# EAGLE design Air_Fryer_Coffee_Roaster_V1.0_2022_11_22_REV_B (EAGLE 9.6.1)

## Sheet 1 of 2
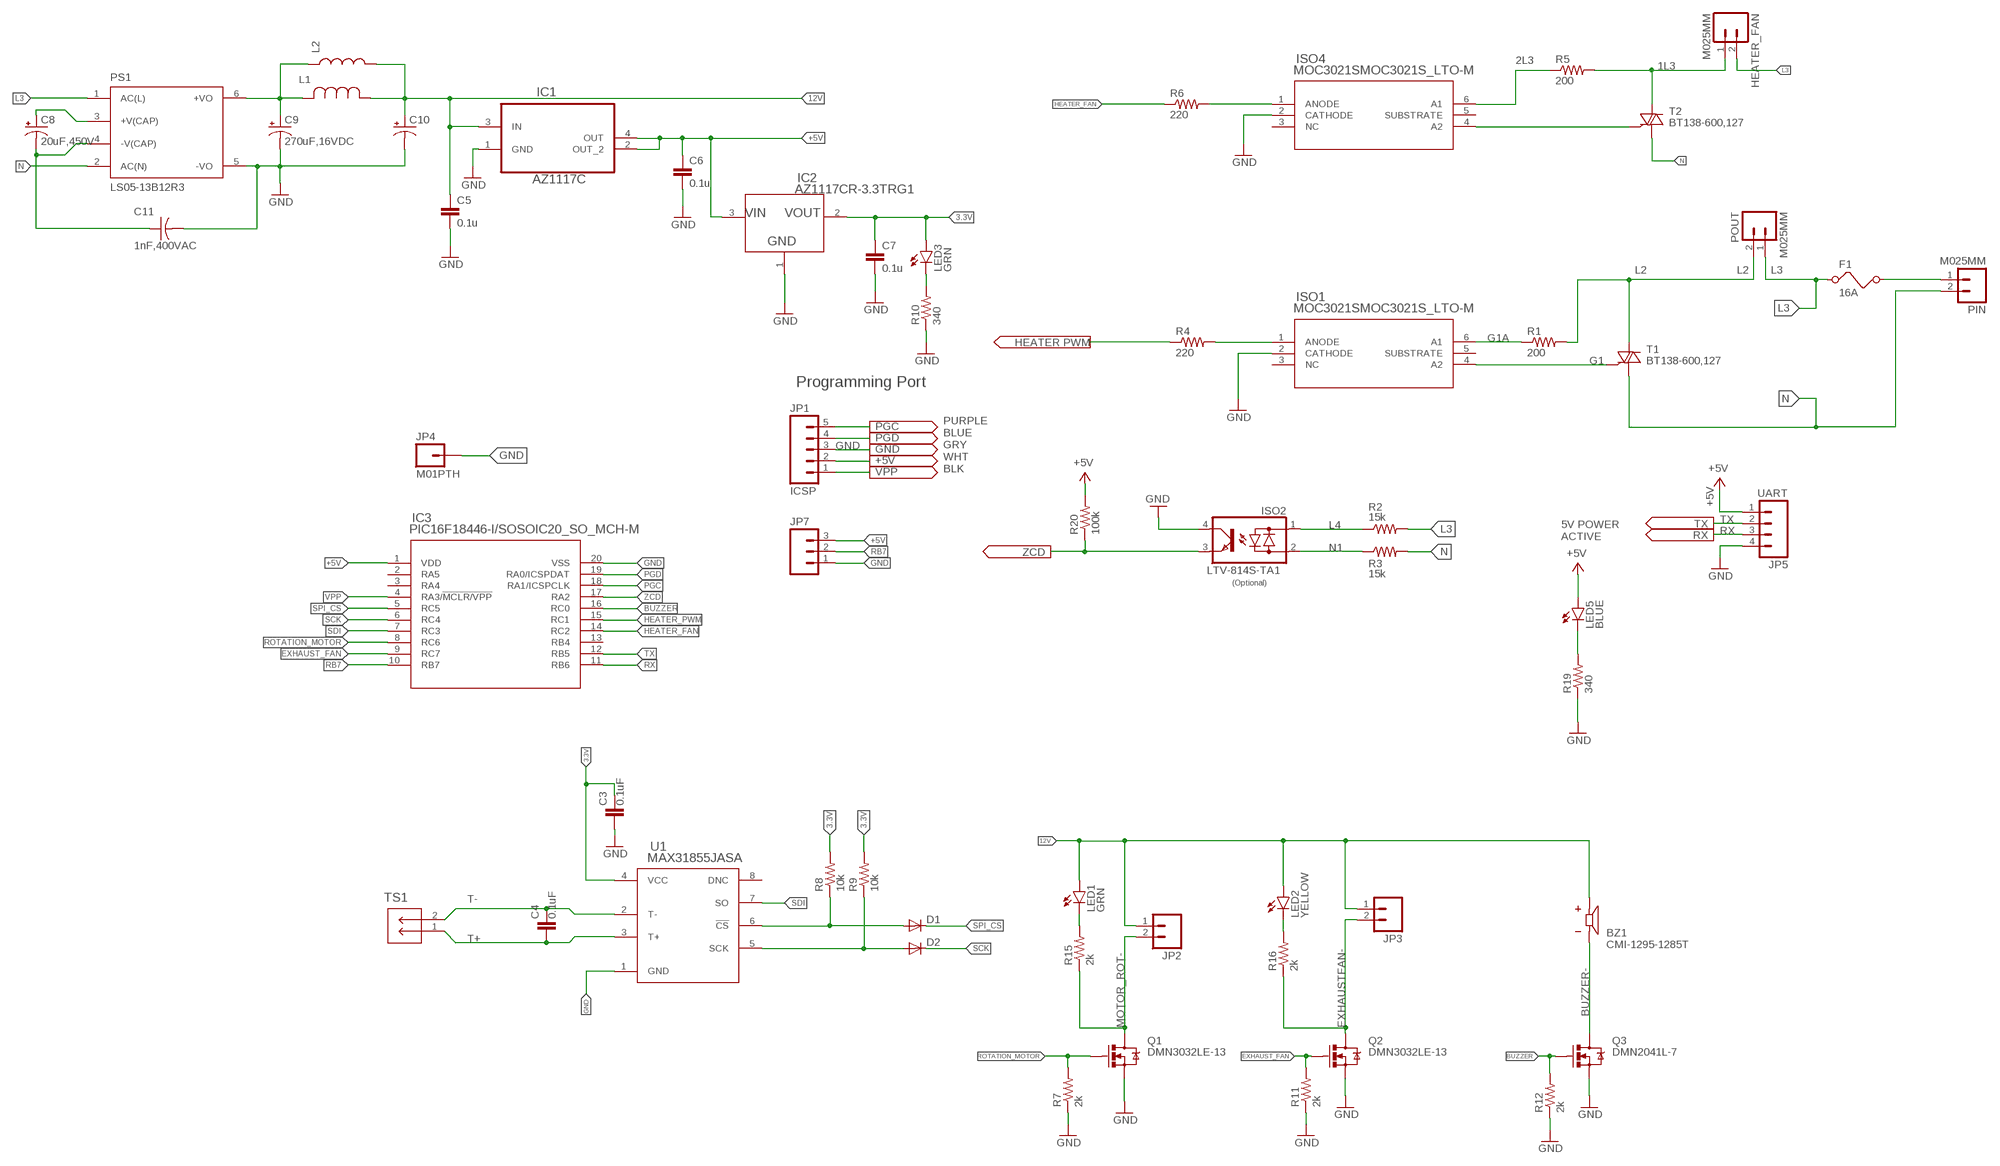
[diagram p0: schematic, sheet 1]

### Parts
BZ1  CMI-1295-1285T  [CUI_CMI-1295-1285T]
C3  0.1uF  CAP0805  [0805]
C4  0.1uF  CAP0805  [0805]
C5  0.1u  CAP1206  [1206]
C6  0.1u  CAP1206  [1206]
C7  0.1u  CAP1206  [1206]
C8  20uF,450V  CPOL-USE5-13  [E5-13]
C9  270uF,16VDC  CAP_POLE  [PANASONIC_E]
C10  CAP_POLE  [PANASONIC_E]
C11  1nF,400VAC  C-US050-075X075  [C050-075X075]
D1  DIODESOD-323F  [SOD-323F]
D2  DIODESOD-323F  [SOD-323F]
F1  16A  FUSE  [FUSE]
HEATER_FAN  M025MM  [SCREWTERMINAL-5MM-2]
IC1  AZ1117C  ADP3338AKCZ-5-R7  [SOT230P700X180-4N]
IC2  AZ1117CR-3.3TRG1  [SOT89_AZ1117_DIO]
IC3  PIC16F18446-I/SOSOIC20_SO_MCH-M  [SOIC20_SO_MCH-M]
ISO1  MOC3021SMOC3021S_LTO-M  [MOC3021S_LTO-M]
ISO2  LTV-814S-TA1  SFH6206  [DIL4-SMD]
ISO4  MOC3021SMOC3021S_LTO-M  [MOC3021S_LTO-M]
JP1  ICSP  M05PTH  [1X05]
JP2  M02POLAR_LOCK  [MOLEX-1X2_LOCK]
JP3  M02POLAR_LOCK  [MOLEX-1X2_LOCK]
JP4  M01PTH  [1X01]
JP5  UART  M04LOCK  [1X04_LOCK]
JP7  M03LOCK  [1X03_LOCK]
L1  4.7uH, 2.2A  SRR1260-100M  [IND_BOURNS_SRR1260]
L2  INDUCTORCR54  [CR54]
LED1  GRN  LED1206  [LED-1206]
LED2  YELLOW  LED1206  [LED-1206]
LED3  GRN  LED1206  [LED-1206]
LED5  BLUE  LED1206  [LED-1206]
PIN  M025MM  [SCREWTERMINAL-5MM-2]
POUT  M025MM  [SCREWTERMINAL-5MM-2]
PS1  LS05-13B12R3  [CONV_LS05-13B12R3]
Q1  DMN3032LE-13  NFET_SOT_223  [SOT223]
Q2  DMN3032LE-13  NFET_SOT_223  [SOT223]
Q3  DMN2041L-7  MOSFET-NCHANNELBSS123LT1G  [SOT23-3]
R1  200  R-US_R2512  [R2512]
R2  15k  R-US_R2512  [R2512]
R3  15k  R-US_R2512  [R2512]
R4  220  RESISTOR1206  [1206]
R5  200  R-US_R2512  [R2512]
R6  220  RESISTOR1206  [1206]
R7  2k  RESISTOR1206  [1206]
R8  10k  R-US_M0805  [M0805]
R9  10k  R-US_M0805  [M0805]
R10  340  RESISTOR1206  [1206]
R11  2k  RESISTOR1206  [1206]
R12  2k  RESISTOR1206  [1206]
R15  2k  RESISTOR1206  [1206]
R16  2k  RESISTOR1206  [1206]
R19  340  RESISTOR1206  [1206]
R20  100k  RESISTOR1206  [1206]
T1  BT138-600,127  BT138-V  [TO220BV]
T2  BT138-600,127  BT138-V  [TO220BV]
TS1  YK3210203000G  282845-2  [CONN2_282845-2_TEC]
U1  MAX31855JASA  MAX31855JASA+21-0041B_8_MXM-M  [21-0041B_8_MXM-M]

### Nets
1L3: HEATER_FAN.1 R5.2 T2.T2(A2)
2L3: ISO4.6(A1) R5.1
3.3V: C3.2 C7.1 IC2.2(OUTPUT) LED3.A R8.2 R9.2 U1.4(VCC)
12V: BZ1.P C5.1 C10.+ IC1.3(IN) JP2.1 JP3.1 L1.1 L2.P$2 LED1.A LED2.A
+5V: C6.1 IC1.2(OUT_2) IC1.4(OUT) IC2.3(INPUT) IC3.1(VDD) JP1.2 JP5.1 JP7.3 LED5.A R20.2
BUZZER: IC3.16(RC0) Q3.1(G) R12.2
BUZZER-: BZ1.N Q3.3(D)
EXHAUST_FAN: IC3.9(RC7) Q2.1(G) R11.2
EXHAUSTFAN-: JP3.2 Q2.2(D) Q2.4(D) R16.1
G1: ISO1.4(A2) T1.G
G1A: ISO1.6(A1) R1.1
GATE_2: ISO4.4(A2) T2.G
GND: C3.1 C5.2 C6.2 C7.2 C9.- C10.- C11.2 IC1.1(GND) IC2.1(ADJ/GND) IC3.20(VSS) ISO1.2(CATHODE) ISO2.4(C) ISO4.2(CATHODE) JP1.3 JP4.1 JP5.4 JP7.1 PS1.5(-VO) Q1.3(S) Q2.3(S) Q3.2(S) R7.1 R10.1 R11.1 R12.1 R19.1 U1.1(GND)
HEATER_FAN: IC3.14(RC2) R6.1
HEATER_PWM: IC3.15(RC1) R4.1
L1: F1.2 PIN.1
L2: POUT.2 R1.2 T1.T2(A2)
L3: F1.1 HEATER_FAN.2 POUT.1 PS1.1(AC(L)) R2.2
L4: ISO2.1(AC1) R2.1
MOTOR_ROT-: JP2.2 Q1.2(D) Q1.4(D) R15.1
N: PIN.2 PS1.2(AC(N)) R3.2 T1.T1(A1) T2.T1(A1)
N1: ISO2.2(AC2) R3.1
N$1: ISO1.1(ANODE) R4.2
N$2: LED3.C R10.2
N$3: LED1.C R15.2
N$4: LED2.C R16.2
N$6: C8.+ PS1.3(+V(CAP))
N$7: C8.- C11.1 PS1.4(-V(CAP))
N$8: ISO4.1(ANODE) R6.2
N$12: D1.A R8.1 U1.6(!CS)
N$13: LED5.C R19.2
N$14: D2.A R9.1 U1.5(SCK)
N$15: C9.+ L1.2 L2.P$1 PS1.6(+VO)
PGC: IC3.18(RA1/ICSPCLK) JP1.5
PGD: IC3.19(RA0/ICSPDAT) JP1.4
RB7: IC3.10(RB7) JP7.2
ROTATION_MOTOR: IC3.8(RC6) Q1.1(G) R7.2
RX: IC3.11(RB6) JP5.3
SCK: D2.C IC3.6(RC4)
SDI: IC3.7(RC3) U1.7(SO)
SPI_CS: D1.C IC3.5(RC5)
T+: C4.1 TS1.1 U1.3(T+)
T-: C4.2 TS1.2 U1.2(T-)
TX: IC3.12(RB5) JP5.2
VPP: IC3.4(RA3/!MCLR/VPP) JP1.1
ZCD: IC3.17(RA2) ISO2.3(E) R20.1
Unconnected: IC3.2(RA5) IC3.3(RA4) IC3.13(RB4) ISO1.3(NC) ISO1.5(SUBSTRATE) ISO4.3(NC) ISO4.5(SUBSTRATE) U1.8(DNC)

### Notes on the sheet
- Programming Port
- PURPLE
  BLUE
  GRY
  WHT
  BLK
- 5V POWER
  ACTIVE
- (Optional)

## Sheet 2 of 2

## Library data of the parts
BZ1 = CMI-1295-1285T:CMI-1295-1285T: CUI Inc Buzzer Check availability <https://pricing.snapeda.com/parts/CMI-1295-1285T/CUI%20Devices/view-part?ref=eda>; AVAILABILITY: In Stock; CUI_PURCHASE_URL: https://www.cuidevices.com/product/audio/buzzers/audio-indicators/cmi-1295-1285t?utm_source=snapeda.com&utm_medium=referral&utm_campaign=snapedaBOM; DESCRIPTION: 12 mm, 12 Vdc, 85 dB, Through Hole, Driving Circuit, Magnetic Audio Indicator Buzzer; MF: CUI Devices; MP: CMI-1295-1285T; PACKAGE: CUI Inc.; PRICE: None; PURCHASE-URL: https://pricing.snapeda.com/search/part/CMI-1295-1285T/?ref=eda
C3 C4 = SparkFun-Capacitors:CAP: Capacitor Standard 0603 ceramic capacitor, and 0.1" leaded capacitor.
C5-C7 = SparkFun:CAP: Capacitor Standard 0603 ceramic capacitor, and 0.1" leaded capacitor.
C8 = rcl:CPOL-US: POLARIZED CAPACITOR, American symbol; SPICEPREFIX: C
C9 C10 = SparkFun:CAP_POL: Capacitor Polarized These are standard SMD and PTH capacitors. Normally 10uF, 47uF, and 100uF in electrolytic and tantalum varieties. Always verify the external diameter of the through hole cap, it varies with capacity, voltage, and manufacturer. The EIA devices should be standard.
C11 = rcl:C-US: CAPACITOR, American symbol; SPICEPREFIX: C
D1 D2 = adafruit:DIODE: Diode SMADIODE - SMA Surface Mount Package 20V 1A Schottky Diode Digikey: 641-1014-6-ND DO-1N4148 - Through Hole Small Current Diode SOD-123 20V 1 A (.5mV Vf) Schottky Diode - Digikey: MBRX120TPMSCT-ND SOD-323 10V 570mA (.38mV Vf, 3ns) Schottky Diode - Digikey: ZLLS410CT-ND SOD-523 30V 30mA Schottky Diode (RB751S-40TE61) - Digikey: RB751S-40TE61CT-ND SOT23-R/W - SOT23 Package (R = Solder Paste/Reflow Ovens, W = Hand-Soldering) BAT54Film 40V 300mA - Digikey: 497-7162-1-ND
F1 = special:FUSE: FUSE 5 x 20 mm
HEATER_FAN PIN POUT = SparkFun-Connectors:M02: Standard 2-pin 0.1" header. Use with - straight break away headers ( PRT-00116) - right angle break away headers (PRT-00553) - swiss pins (PRT-00743) - machine pins (PRT-00117) - female headers (PRT-00115) Molex polarized connector foot print use with: PRT-08233 with associated crimp pins and housings. 2.54_SCREWTERM for use with PRT-10571. 3.5mm Screw Terminal footprints for PRT-08084 5mm Screw Terminal footprints for use with PRT-08432; STOREFRONT_ID: PRT-08432
IC1 = ADI-Phase-2:ADP3338AKCZ-5-R7: Low Dropout Regulator; MPN: ADP3338AKCZ-5-R7; OC_FARNELL: 1319314; OC_NEWARK: 19M8721; PACKAGE: SOT-223-3; SUPPLIER: Analog Devices
IC2 = AZ1117CR-3.3TRG1:AZ1117CR-3.3TRG1; COPYRIGHT: Copyright (C) 2022 Ultra Librarian. All rights reserved.; DIGI-KEY_PART_NUMBER_1: AZ1117CR-3.3TRG1DITR-ND; DIGI-KEY_PART_NUMBER_2: AZ1117CR-3.3TRG1DICT-ND; DIGI-KEY_PART_NUMBER_3: AZ1117CR-3.3TRG1DIDKR-ND; MANUFACTURER_PART_NUMBER: AZ1117CR-3.3TRG1; MFR_NAME: Diodes Inc
IC3 = PIC16F18446:PIC16F18446-I/SO; COPYRIGHT: Copyright (C) 2022 Ultra Librarian. All rights reserved.; MANUFACTURER_PART_NUMBER: PIC16F18446-I/SO; MFR_NAME: Microchip
ISO1 ISO4 = MOC3021S:MOC3021S; BUILT_BY: EMA_Cory; COPYRIGHT: Copyright (C) 2018 Accelerated Designs. All rights reserved; MANUFACTURER_PART_NUMBER: MOC3021S; SOURCELIBRARY: Lite-On_2019-12-03; VENDOR: Lite-On
ISO2 = optocoupler:SFH620: Optocoupler, Phototransistor Output, AC Input Source: http://www.vishay.com/docs/83675/sfh620.pdf; MF: VISHAY/TELEFUNKEN; MPN: SFH6206-3; OC_FARNELL: 1469585; OC_NEWARK: 58K2214
JP1 = SparkFun-Connectors:M05: Header 5 Standard 5-pin 0.1" header. Use with straight break away headers (SKU : PRT-00116), right angle break away headers (PRT-00553), swiss pins (PRT-00743), machine pins (PRT-00117), and female headers (PRT-00115). Molex polarized connector foot print use with SKU : PRT-08230 with associated crimp pins and housings.
JP2 JP3 = SparkFun:M02: Header 2 Standard 2-pin 0.1" header. Use with straight break away headers (SKU : PRT-00116), right angle break away headers (PRT-00553), swiss pins (PRT-00743), machine pins (PRT-00117), and female headers (PRT-00115). Molex polarized connector foot print use with SKU : PRT-08233 with associated crimp pins and housings.
JP4 = SparkFun-Connectors:M01: Header 1 Standard 1-pin 0.1" header. Use with straight break away headers (SKU : PRT-00116), right angle break away headers (PRT-00553), swiss pins (PRT-00743), machine pins (PRT-00117), and female headers (PRT-00115).
JP5 = SparkFun-Connectors:M04: Header 4 Standard 4-pin 0.1" header. Use with straight break away headers (SKU : PRT-00116), right angle break away headers (PRT-00553), swiss pins (PRT-00743), machine pins (PRT-00117), and female headers (PRT-00115). Molex polarized connector foot print use with SKU : PRT-08231 with associated crimp pins and housings. 1MM SMD Version SKU: PRT-10208
JP7 = SparkFun:M03: Header 3 Standard 3-pin 0.1" header. Use with straight break away headers (SKU : PRT-00116), right angle break away headers (PRT-00553), swiss pins (PRT-00743), machine pins (PRT-00117), and female headers (PRT-00115). Molex polarized connector foot print use with SKU : PRT-08232 with associated crimp pins and housings.
L1 = SRR1260 Series:SRR1260-100M; COPYRIGHT: Copyright (C) 2021 Ultra Librarian. All rights reserved.; DIGI-KEY_PART_NUMBER_1: SRR1260-100MCT-ND; DIGI-KEY_PART_NUMBER_2: SRR1260-100MDKR-ND; DIGI-KEY_PART_NUMBER_3: SRR1260-100MTR-ND; MANUFACTURER_PART_NUMBER: SRR1260-100M; MFR_NAME: Bourns Electronics
L2 = SparkFun:INDUCTOR: Inductors Basic Inductor/Choke - 0603 and 1206. Footprints are not proven and vary greatly between part numbers.
LED1-LED3 LED5 = SparkFun-LED:LED: LEDs Standard schematic elements and footprints for 5mm, 3mm, 1206, and 0603 sized LEDs. 5mm - Spark Fun Electronics SKU : COM-00529 (and others)
PS1 = LS05-13B12R3:LS05-13B12R3; DESCRIPTION: Open Frame AC DC Converters 1 Uitgang 12V - - - 420mA 85 ~ 305 VAC, 70 ~ 430 VDC Input; DIGI-KEY_PART_NUMBER: 2725-LS05-13B12R3-ND; MF: Mornsun America, LLC; MP: LS05-13B12R3; PACKAGE: CUSTOM-6 MORNSUN; PURCHASE-URL: https://pricing.snapeda.com/search/part/LS05-13B12R3/?ref=eda
Q1 Q2 = NFET_LIB:NFET_SOT_223
Q3 = SparkFun-DiscreteSemi:MOSFET-NCHANNEL: Common NMOSFET Parts MFG P/N Store ID Prod ID FDD8780 TRANS-09984 SI7820DN TRANS-11055 FDS6630A IC-08089 2N7002PW TRANS-11151 FQP30N06L COM-10213 TRANS-10060 BSS123LT1G TRANS-08345 BSS138 TRANS-00830 BS170 2N7000; PROD_ID: TRANS-08345
R1-R3 R5 = rcl:R-US_: RESISTOR, American symbol; SPICEPREFIX: R
R4 R6 R7 R10-R12 R15 R16 R19 R20 = SparkFun-Resistors:RESISTOR: Resistor Basic schematic elements and footprints for 0603, 1206, and PTH resistors.
R8 R9 = adafruit:R-US_: RESISTOR, American symbol
T1 T2 = triac:BT138: TRIAC Source: http://www.semiconductors.philips.com BT138_SERIES_2.pdf
TS1 = 7_62_2pole_term_block:282845-2; COPYRIGHT: Copyright (C) 2022 Ultra Librarian. All rights reserved.; MANUFACTURER_PART_NUMBER: 282845-2; MFR_NAME: TE Connectivity
U1 = MAX31855:MAX31855JASA+; COPYRIGHT: Copyright (C) 2022 Ultra Librarian. All rights reserved.; MANUFACTURER_PART_NUMBER: MAX31855JASA+; MFR_NAME: Maxim Integrated Products

## Board
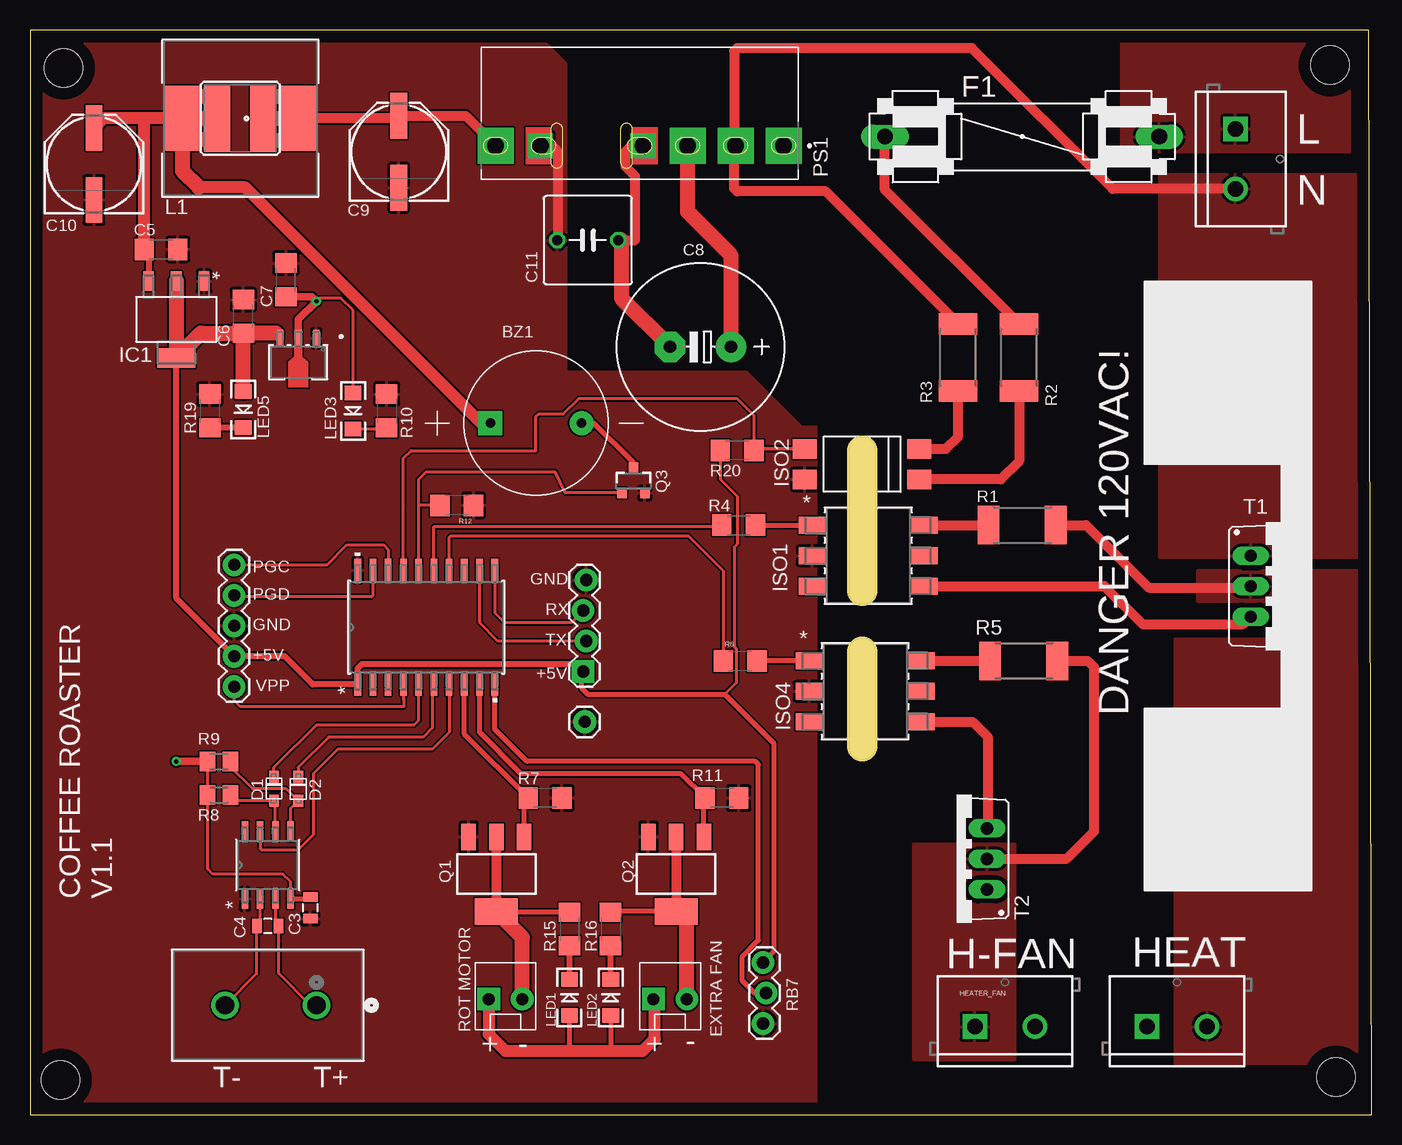
[diagram p1: board, top side]
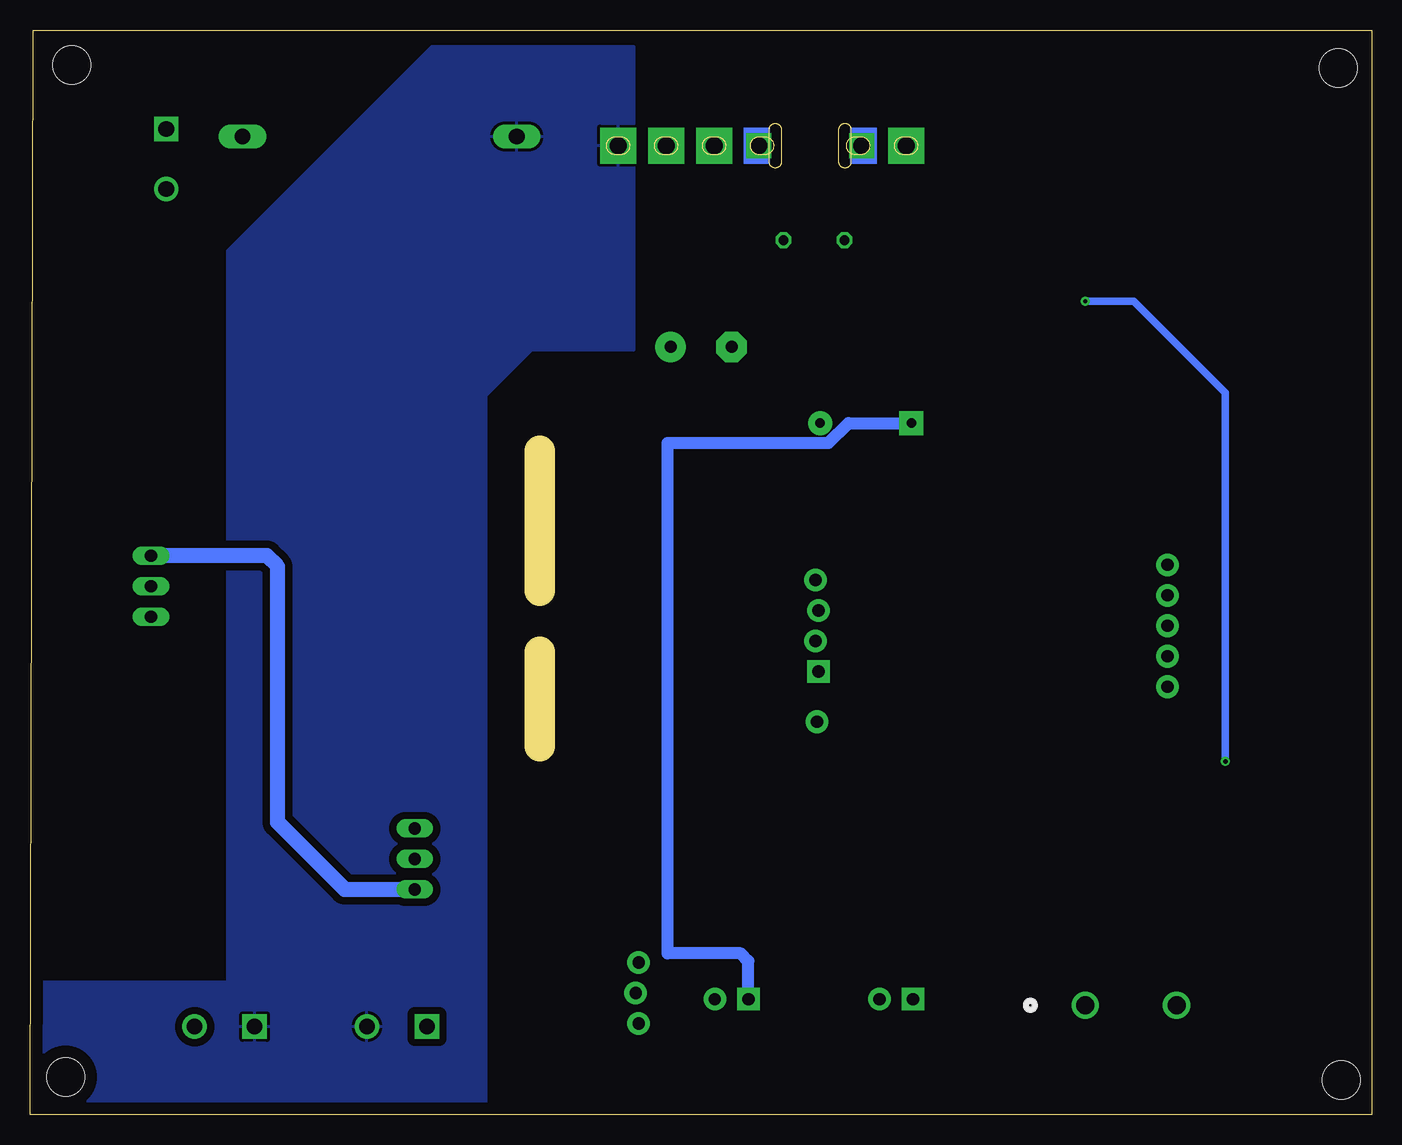
[diagram p2: board, bottom side, seen from below]

Size 111.81 x 90.41 mm. Coordinates in mm from the lower left corner, seen from the top.
Outline: 69.34,55.24 69.34,43.94
Outline: 0,0 111.81,0 111.56,90.41 0,90.41 0,0
Copper layers (1*16): Top 0.035mm / dielectric 1.5mm / Bottom 0.035mm
Design rules "default": minimum track width 10mil, minimum drill 0.35mm, track to track 6mil, track to pad 6mil, pad to pad 6mil, via to via 6mil, smd to smd 6mil, copper to edge 40mil, drill to drill 6mil, minimum pad ring 10mil, minimum via ring 8mil, stop-mask expansion 4mil, vias tented up to drill 0mil, thermal gap 10mil
Holes 3.17 mm at 2.54,2.92 108.84,3.17 108.33,87.5 2.79,87.25
tKeepout: area 66.8,2.8 to 71.9,56.8
Milling: 2 lines

### Footprints (pad centres in the part's own frame; a part is rotated, then mirrored left to right if it is on the bottom)
CUI_CMI-1295-1285T = drill 0.8 pad 2: N 3.8,0 | drill 0.8 pad 2 square: P -3.8,0
0805 = smd 0.8 x 1.2: 1 -0.9,0; 2 0.9,0
1206 = smd 1.6 x 1.8: 1 -1.4,0; 2 1.4,0
E5-13 = drill 1.016 pad 2.54: + -2.54,0 | drill 1.016 pad 2.54 octagon: - 2.54,0
PANASONIC_E = smd 3.8 x 1.4: + 3,0; - -3,0
C050-075X075 = drill 0.813 octagon: 1 -2.54,0; 2 2.54,0
SOD-323F = smd 1 x 0.8: A -1,0; C 1,0
FUSE = drill 1.321 long: 1 -11.43,0; 2 11.43,0
SCREWTERMINAL-5MM-2 = drill 1.3 pad 2.032 square: 1 0,0 | drill 1.3 pad 2.032: 2 5,0
SOT230P700X180-4N = smd 1.626 x 0.889: 1 -3.2,2.311; 2 -3.2,0; 3 -3.2,-2.311 | smd 1.626 x 3.175: 4 3.2,0
SOT89_AZ1117_DIO = smd 0.533 x 1.397: 1 -1.5,-1.994; 3 1.5,-1.994 | smd 0.61 x 1.397: 2 0,-1.994
SOIC20_SO_MCH-M = smd 1.905 x 0.559: 1 -4.763,5.715; 2 -4.763,4.445; 3 -4.763,3.175; 4 -4.763,1.905; 5 -4.763,0.635; 6 -4.763,-0.635; 7 -4.763,-1.905; 8 -4.763,-3.175; 9 -4.763,-4.445; 10 -4.763,-5.715; 11 4.763,-5.715; 12 4.763,-4.445; 13 4.763,-3.175; 14 4.763,-1.905; 15 4.763,-0.635; 16 4.763,0.635; 17 4.763,1.905; 18 4.763,3.175; 19 4.763,4.445; 20 4.763,5.715
MOC3021S_LTO-M = smd 2.261 x 1.397: 1 -4.661,2.54; 2 -4.661,0; 3 -4.661,-2.54; 4 4.661,-2.54; 5 4.661,0; 6 4.661,2.54
DIL4-SMD = smd 1.6 x 2: 1 -1.27,-4.77; 2 1.27,-4.77; 3 1.27,4.77; 4 -1.27,4.77
1X05 = drill 1.016 pad 1.88: 1 0,0; 2 2.54,0; 3 5.08,0; 4 7.62,0; 5 10.16,0
MOLEX-1X2_LOCK = drill 1.016 pad 1.88 square: 1 -0.127,0 | drill 1.016 pad 1.88: 2 2.667,0
1X01 = drill 1.016 pad 1.88: 1 0,0
1X04_LOCK = drill 1.016 pad 1.88 square: 1 0,0.127 | drill 1.016 pad 1.88: 2 2.54,-0.127; 3 5.08,0.127; 4 7.62,-0.127
1X03_LOCK = drill 1.016 pad 1.88: 1 0,0.127; 2 2.54,-0.127; 3 5.08,0.127
IND_BOURNS_SRR1260 = smd 2.896 x 5.41: 1 -4.851,0; 2 4.851,0
CR54 = smd 5.5 x 2.15: P$1 0,1.92; P$2 0,-1.92
LED-1206 = smd 1.2 x 1.4: A -1.5,0; C 1.5,0
CONV_LS05-13B12R3 = drill 1.4 pad 3 square: 1 -12,0; 2 -8,0; 3 -4,0; 6 12,0 | drill 1.4 pad 1.78 square: 4 -0.29,0; 5 8.29,0
SOT223 = smd 1.219 x 2.235: 1 -2.311,-3.099; 2 0,-3.099; 3 2.311,-3.099 | smd 3.6 x 2.2: 4 0,3.099
SOT23-3 = smd 0.8 x 0.9: 1 -0.95,-1; 2 0.95,-1; 3 0,1.1
R2512 = smd 1.8 x 3.2: 1 -2.8,0; 2 2.8,0
M0805 = smd 1.3 x 1.6: 1 -0.95,0; 2 0.95,0
TO220BV = drill 1.016 long: G 2.54,-2.54; T1 -2.54,-2.54; T2 0,-2.54
CONN2_282845-2_TEC = drill 1.524 pad 2.032: 1 0,0; 2 7.62,0
21-0041B_8_MXM-M = smd 1.664 x 0.533: 1 -2.826,1.905; 2 -2.826,0.635; 3 -2.826,-0.635; 4 -2.826,-1.905; 5 2.826,-1.905; 6 2.826,-0.635; 7 2.826,0.635; 8 2.826,1.905

### Placement (x,y rotation side)
BZ1  42.16,57.66 0 top
C3  23.37,17.27 90 top
C4  19.81,15.75 180 top
C5  10.92,72.14 0 top
C6  17.78,66.55 90 top
C7  21.34,69.6 90 top
C8  55.88,64.01 180 top
C9  30.73,80.26 90 top
C10  5.33,79.25 90 top
C11  46.48,72.9 180 top
D1  20.32,27.19 90 top
D2  22.35,27.18 90 top
F1  82.68,81.53 0 top
HEATER_FAN  78.74,7.37 0 top
HEATSINK  [7-345-2PP-BA]  106.81,44.07 90 top
IC1  12.19,66.29 270 top
IC2  22.35,62.74 180 top
IC3  33.02,40.64 90 top
ISO1  69.85,46.61 0 top
ISO2  69.34,54.23 90 top
ISO4  69.6,35.31 0 top
JP1  17.02,35.69 90 top
JP2  38.35,9.65 0 top
JP3  52.07,9.65 0 top
JP4  46.23,32.77 0 top
JP5  46.23,36.96 90 top
JP7  61.21,7.62 90 top
L1  17.53,83.06 0 top
L2  17.53,83.06 270 top
LED1  44.96,9.78 90 top
LED2  48.39,9.78 90 top
LED3  26.92,58.67 270 top
LED5  17.78,58.8 270 top
PIN  100.46,82.17 270 top
POUT  93.09,7.37 0 top
PS1  50.8,80.77 180 top
Q1  38.86,20.07 180 top
Q2  53.85,20.07 180 top
Q3  50.29,52.83 0 top
R1  82.68,49.15 0 top
R2  82.42,63.12 90 top
R3  77.34,63.12 90 top
R4  59.05,49.15 0 top
R5  82.8,37.85 0 top
R6  59.18,37.85 0 top
R7  42.93,26.42 180 top
R8  15.75,26.67 180 top
R9  15.75,29.46 180 top
R10  29.72,58.67 270 top
R11  57.66,26.42 180 top
R12  35.56,50.8 180 top
R15  44.96,15.49 270 top
R16  48.39,15.49 270 top
R19  14.99,58.67 270 top
R20  58.93,55.37 180 top
T1  104.27,44.07 270 top
T2  77.22,21.34 90 top
TS1  23.88,9.14 180 top
U1  19.81,20.83 90 top

### Tracks (layer width: path | path; a pad name or v marks a point on that pad's centre or on a via)
1L3
  Top 0.813: R5.2 88.14,37.85 88.65,37.34 88.65,23.62 86.33,21.31 79.78,21.31 T2.T2
  pour Top (isolate 0.406): 73.66,22.61 82.04,22.61 82.04,4.57 73.66,4.57
2L3
  Top 0.813: ISO4.6 R5.1
3.3V  (via drill 0.35)
  Top 0.254: R9.2 R8.2 14.8,20.51 15.24,20.07 21.08,20.07 21.72,19.43 U1.4 | LED3.A 26.92,67.06 25.91,68.07 24.13,68.07 v23.88,67.82
  Top 0.406: U1.4 23.22,18 C3.2
  Top 0.61: R9.2 v12.19,29.46 | IC2.2 22.35,66.29 v23.88,67.82 23.5,68.2 C7.1
  Bottom 0.61: v12.19,29.46 12.19,60.2 19.81,67.82 v23.88,67.82
12V
  Top 0.406: LED1.A 44.96,5.33 | LED2.A 48.39,5.46 48.26,5.33
  Top 0.508: C5.1 9.88,71.78 IC1.3
  Top 1.016: JP2.1 38.23,6.73 39.62,5.33 44.96,5.33 48.26,5.33 51.05,5.33 52.07,6.35 52.07,9.53 JP3.1 | BZ1.P 37.6,57.66 17.96,77.3 14.06,77.3 | 9.4,83.06 L1.1 13.21,83.59 13.21,83.82 12.7,83.31 12.7,82.8 | 9.4,83.06 6.14,83.06 C10.+ | C5.1 9.52,82.93 9.4,83.06
  Top 1.27: 14.06,77.3 12.7,78.66 12.7,81.28 | 12.7,81.28 12.7,82.8 12.7,84.58 12.95,84.84 15.49,84.84 15.49,83.17 L2.P$2 | L1.1 L2.P$2 | L2.P$2 15.61,81.39 15.49,81.28 12.7,81.28
  Top 2.54: 12.95,83.06 12.7,83.31
  Bottom 1.016: JP3.1 51.94,12.83 52.58,13.46 58.67,13.46 58.67,56 45.28,56 43.62,57.66 BZ1.P
+5V
  Top 0.254: R20.2 57.53,52.96 58.93,51.56 58.93,47.56 58.67,47.31 58.67,39.05 58.86,38.86 58.86,36 57.91,35.05 | 45.97,35.56 45.97,35.81
  Top 0.406: JP7.3 61.98,13.59 61.98,30.99 57.91,35.05 46.48,35.05 45.97,35.56 | 45.97,35.81 45.97,36.83 JP5.1
  Top 0.508: IC1.4 12.19,43.05 JP1.2 21.21,38.23 23.56,35.88 IC3.1 27.3,37.21 27.69,37.59 45.47,37.59 JP5.1
  Top 0.61: IC2.3 20.52,65.06 20.52,65.15
  Top 1.27: C6.1 14.25,65.15 IC1.4 IC1.2 | 20.52,65.15 C6.1 | LED5.A C6.1
BUZZER
  Top 0.254: IC3.16 32.38,50.8 | 32.38,50.8 32.38,52.96 33.02,53.59 43.76,53.59 44.59,51.83 Q3.1 48.91,51.83 | R12.2 32.38,50.8
BUZZER-
  Top 0.406: BZ1.N 46.98,57.66 50.29,54.35 Q3.3
EXHAUST_FAN
  Top 0.406: Q2.1 56.16,26.32 R11.2 54.23,28.45 40.89,28.45 37.47,31.88 IC3.9
EXHAUSTFAN-
  Top 0.406: Q2.4 48.46,16.97
  Top 0.508: R16.1 48.77,17.27
  Top 0.813: Q2.2 Q2.4 | 48.46,16.97 R16.1
  Top 1.27: JP3.2 54.74,16.08 Q2.4
G1
  Top 0.813: ISO1.4 89.53,44.07 92.71,40.89 101.09,40.89 T1.G
G1A
  Top 0.813: ISO1.6 R1.1
GATE_2
  Top 0.813: ISO4.4 78.56,32.77 79.81,31.52 79.81,23.93 T2.G
GND
  Top 0.813: PS1.5 42.65,80.64 43.63,80.64 43.96,80.31 43.96,72.9 C11.2
  pour Top: -7.11,89.66 42.67,89.66 44.7,87.63 44.7,61.98 59.69,61.98 64.26,57.4 65.53,57.4 65.53,-0.25 65.02,-0.76 -8.38,-0.76 -8.64,-1.02 -8.64,88.14
HEATER_FAN
  Top 0.254: IC3.14 34.92,48.13 35.05,48.26 54.86,48.26 57.78,45.34 R6.1
HEATER_PWM
  Top 0.254: IC3.15 33.66,49.02 57.53,49.02 R4.1
L1
  pour Top (isolate 0.406): 90.93,80.26 109.98,80.26 109.98,89.79 90.93,89.79
L2
  Top 0.813: R1.2 88.01,49.15 93.22,43.94 101.6,43.94 T1.T2
  pour Top (isolate 0.406): 110.62,45.34 97.28,45.34 97.28,42.8 104.27,42.8 104.27,39.62 95.38,39.62 95.38,4.32 110.62,4.32
L3
  Top 0.813: 82.42,65.66 R2.2 71.25,77.09 F1.1
  pour Bottom (isolate 0.61): 95.38,11.05 111.89,11.05 111.89,-0.38 73.79,-0.38 73.79,59.94 69.98,63.75 61.47,63.75 61.47,89.03 78.36,89.03 95.38,72.01
L4
  Top 0.813: R2.1 82.42,54.48 80.9,52.96 ISO2.1
MOTOR_ROT-
  Top 0.406: R15.1 38.94,16.89 Q1.4
  Top 0.508: R15.1 44.96,17.27 44.65,16.97
  Top 0.813: Q1.2 Q1.4
  Top 1.27: JP2.2 41.02,14.81 Q1.4
N
  Top 0.813: PIN.2 90.22,77.17 78.49,88.9 58.93,88.9 58.67,88.65 58.67,80.9 | 58.67,80.9 PS1.2 | R3.2 66.3,76.96 58.93,76.96 58.67,77.22 58.67,80.9
  Bottom 1.27: T1.T1 92.08,46.61 91.19,45.72 91.19,24.38 85.6,18.8 T2.T1
  pour Top (isolate 0.813): 94.11,46.48 111.25,46.48 111.25,78.36 94.11,78.36
N1
  Top 0.813: ISO2.2 76.33,55.5 77.34,56.52 R3.1
N$1
  Top 0.406: R4.2 ISO1.1
N$2
  Top 0.254: LED3.C 29.62,57.17 R10.2
N$3
  Top 0.508: R15.2 LED1.C
N$4
  Top 0.508: LED2.C R16.2
N$6
  Top 1.27: C8.+ 58.42,71.63 54.8,75.25 PS1.3
N$7
  Top 0.813: PS1.4 50.95,80.64 49.97,80.64 49.64,80.31 49.64,79.04 50.43,78.24 50.43,72.9 49.28,72.9 C11.1
  Top 1.27: 49.28,72.9 49.28,68.07 C8.-
N$8
  Top 0.406: ISO4.1 R6.2
N$12
  Top 0.254: U1.6 20.45,26.07 D1.A 17.17,26.19 R8.1
N$13
  Top 0.508: LED5.C 17.75,57.27 R19.2
N$14
  Top 0.254: U1.5 21.72,25.54 D2.A 21.35,27.18 18.54,27.18 16.7,29.02 R9.1
N$15
  Top 0.813: L1.2 30.53,83.06 C9.+ 36.31,83.26 PS1.6
  Top 1.27: 19.45,81.17 19.3,81.03 | 19.45,81.17 L2.P$1 L1.2 | L1.2 22.38,81.31 22.24,81.17 19.45,81.17 | 22.73,84.71 22.61,84.84 22.38,84.61 L1.2 | L1.2 22.38,84.84 19.56,84.84
PGC
  Top 0.254: JP1.5 24.77,45.85 26.42,47.5 29.46,47.5 29.84,47.12 IC3.18
PGD
  Top 0.254: IC3.19 28.57,43.31 28.45,43.18 17.14,43.18 JP1.4
RB7
  Top 0.406: JP7.2 60.38,10.16 59.36,11.18 59.36,13.21 60.71,14.55 60.71,29.21 60.45,29.46 41.4,29.46 38.73,32.13 IC3.10
ROTATION_MOTOR
  Top 0.406: Q1.1 41.17,26.06 R7.2 36.2,31.75 IC3.8
RX
  Top 0.254: IC3.11 38.73,41.85 39.56,41.02 45.09,41.02 JP5.3
SCK
  Top 0.254: IC3.6 33.53,35.75 33.53,32.26 32.77,31.5 24.89,31.5 22.35,28.96 D2.C
SDI
  Top 0.254: 19.18,22.99 U1.7 19.18,22.23 19.3,22.1 22.35,22.1 23.62,23.37 23.62,28.45 25.65,30.48 33.53,30.48 34.92,31.88 IC3.7
SPI_CS
  Top 0.254: D1.C 20.32,28.96 23.88,32.51 32,32.51 32.38,32.89 IC3.5
T+
  Top 0.254: TS1.1 23.37,9.14 20.71,11.8 C4.1 20.5,15.96 20.5,17.95 U1.3
T-
  Top 0.254: TS1.2 18.91,11.8 C4.2 19.18,16.01 U1.2
TX
  Top 0.254: JP5.2 38.99,39.5 37.47,41.02 IC3.12
VPP
  Top 0.254: IC3.4 31.12,34.71 31.17,34.66 31.17,34.04 17.53,34.04 17.02,34.54 JP1.1
ZCD
  Top 0.254: R20.1 60.33,58.29 58.93,59.69 45.72,59.69 44.45,58.42 42.42,58.42 42.16,58.17 42.16,55.37 31.75,55.37 31.12,54.74 31.12,50.8 IC3.17
  Top 0.305: ISO2.3 60.45,55.5 R20.1

### Text on the board
tPlace: COFFEE ROASTER / V1.1
tNames: L | N | PGC | GND | PGD | RX | GND | TX | +5V | +5V | VPP | DANGER 120VAC! | H-FAN | HEAT | ROT MOTOR | EXTRA FAN | RB7 | + | - | + | - | T- | T+
tValues: LINE